# Altium schematic sheet POW_Schematic4.SchDoc
size A4
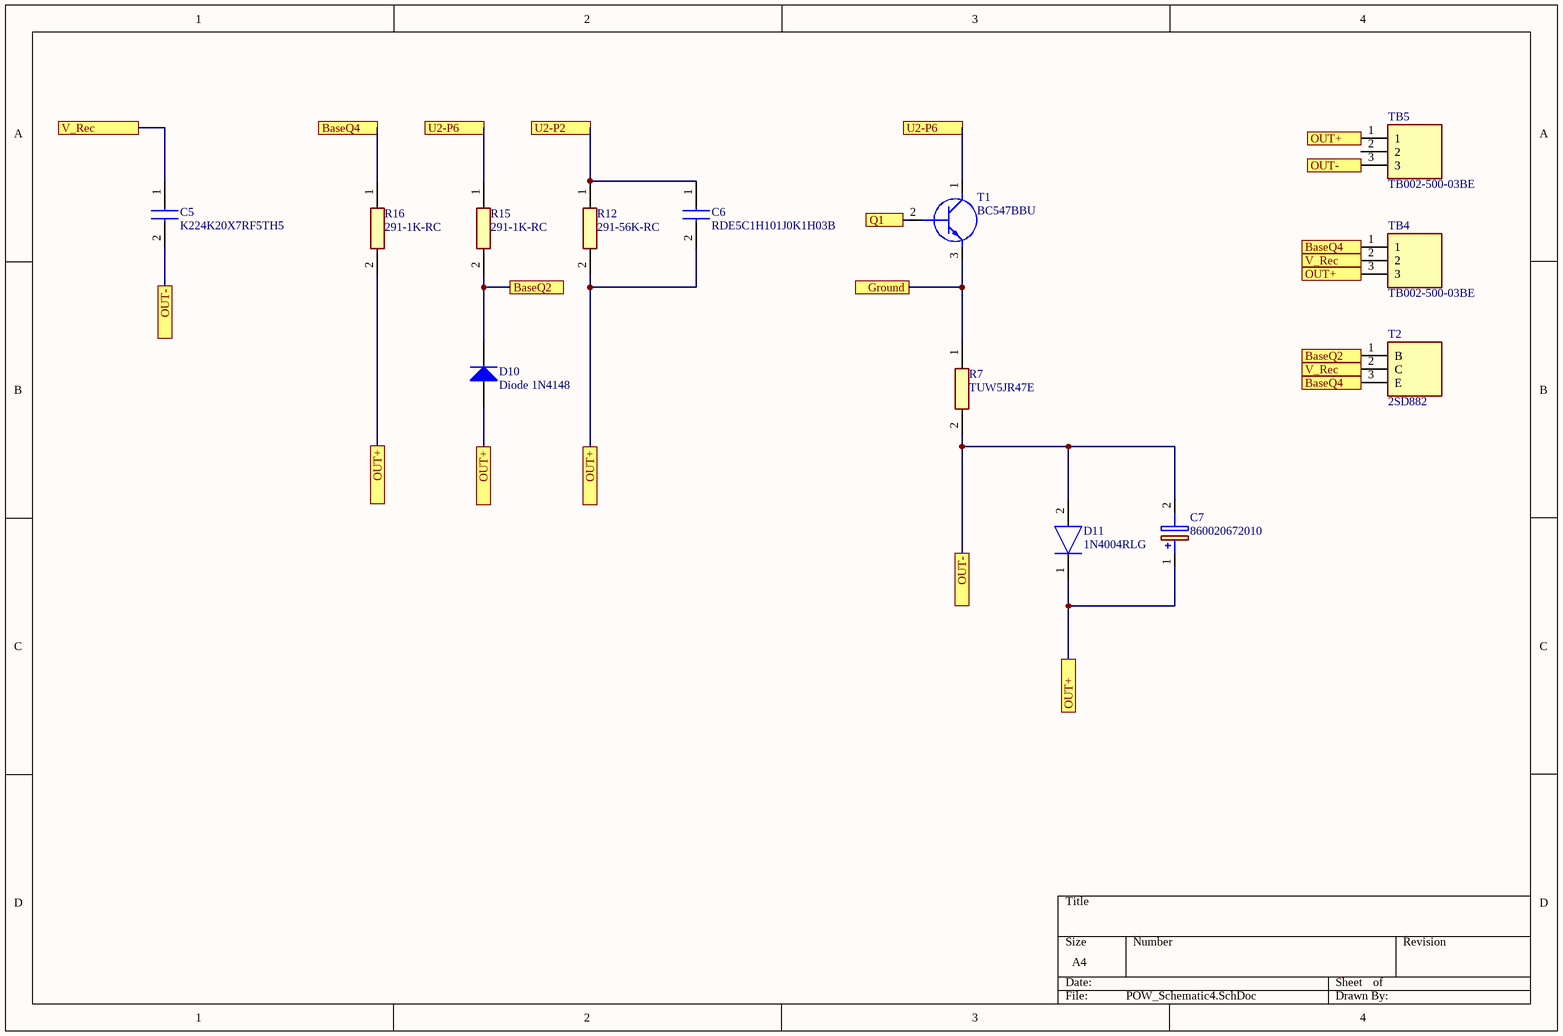
[diagram p0: POW_Schematic4.SchDoc]

## Parts
C5  K224K20X7RF5TH5  [K224K20X7RF5TH5]
C6  RDE5C1H101J0K1H03B  [RCE5C1H103J1A2H03B]
C7  860020672010  [CAPPRD200W52D500H1250]
D10  Diode 1N4148  [DO-35]
D11  1N4004RLG  [DIOAD1405W86L465D235]
R7  TUW5JR47E  [TUW5JR47E]
R12  291-56K-RC  [291-XXX-RC-Type]
R15  291-1K-RC  [291-XXX-RC-Type]
R16  291-1K-RC  [291-XXX-RC-Type]
T1  BC547BBU  [SS9018HBU]
T2  2SD882  [TO254P290X760X1320-3P]
TB4  TB002-500-03BE  [SHDR3W100P0X500_1X3_1500X760X1000P]
TB5  TB002-500-03BE  [SHDR3W100P0X500_1X3_1500X760X1000P]

## Ports
BaseQ2, BaseQ4, Ground, OUT+, OUT-, Q1, U2-P2, U2-P6, V_Rec

## Nets
BaseQ2: D10.2(K) R15.2 T2.1(B) ; port BaseQ2
BaseQ4: R16.1 T2.3(E) TB4.1 ; port BaseQ4
Ground: R7.1 T1.3(E) ; port Ground
OUT+: C6.2 C7.1(+) D10.1(A) D11.1(K) R12.2 R16.2 TB4.3 TB5.1 ; port OUT+
OUT-: C5.2 C7.2(-) D11.2(A) R7.2 TB5.3 ; port OUT-
Q1: T1.2(B) ; port Q1
U2-P2: C6.1 R12.1 ; port U2-P2
U2-P6: R15.1 T1.1(C) ; port U2-P6
V_Rec: C5.1 T2.2(C) TB4.2 ; port V_Rec

Not connected (* = marked no-connect by the designer): TB5 2

## Library data of the parts
C5 = K224K20X7RF5TH5: Capacitor; Manufacturer_Name: Vishay; Allied_Number: 70122947; Datasheet Link: http://www.vishay.com/docs/45171/kseries.pdf; Height: 5mm; Manufacturer_Part_Number: K224K20X7RF5TH5; Mouser Part Number: 594-K224K20X7RF5TH5; Mouser Price/Stock: https://www.mouser.com/Search/Refine.aspx?Keyword=594-K224K20X7RF5TH5; RS Part Number: 8523328; RS Price/Stock: http://uk.rs-online.com/web/p/products/8523328; Allied Price/Stock: https://www.alliedelec.com/bccomponents-vishay-k224k20x7rf5th5/70122947/
C6 = RDE5C1H101J0K1H03B: Capacitor; Manufacturer_Name: Murata Electronics; Datasheet Link: https://psearch.en.murata.com/capacitor/product/RDE5C1H101J0K1H03B.html; Height: 5mm; Manufacturer_Part_Number: RDE5C1H101J0K1H03B; Mouser Part Number: 81-RDE5C1H101J0K1H3B; Mouser Price/Stock: https://www.mouser.com/Search/Refine.aspx?Keyword=81-RDE5C1H101J0K1H3B
C7 = 860020672010: Capacitor Polarised; Manufacturer_Name: Wurth Elektronik; Datasheet Link: https://katalog.we-online.de/pbs/datasheet/860020672010.pdf; Height: 12.5mm; Manufacturer_Part_Number: 860020672010; Mouser Part Number: 710-860020672010; Mouser Price/Stock: https://www.mouser.com/Search/Refine.aspx?Keyword=710-860020672010; RS Part Number: 8396621P; RS Price/Stock: http://uk.rs-online.com/web/p/products/8396621P
D10 = Diode 1N4148: High Conductance Fast Diode; Published: 8-Jun-2000; LatestRevisionDate: 17-Jul-2002; LatestRevisionNote: Re-released for DXP Platform.; DatasheetVersion: 1997; PackageReference: DO-35; Publisher: Altium Limited; PackageDescription: Diode, Axial; Body 3.8 x 1.9 mm (LxDia. max), Lead Dia. 0.53 mm (max); Code_JEDEC: DO-204-AH; ComponentLink1Description: Manufacturer Link; ComponentLink1URL: http://www.fairchildsemi.com/; ComponentLink2Description: Datasheet; ComponentLink2URL: http://www.fairchildsemi.com/ds/1N%2F1N4148.pdf
D11 = 1N4004RLG: Diode; Manufacturer_Name: ON Semiconductor; Datasheet Link: http://www.onsemi.com/pub/Collateral/1N4001-D.PDF; Manufacturer_Part_Number: 1N4004RLG; Mouser Part Number: 863-1N4004RLG; Mouser Price/Stock: https://www.mouser.com/Search/Refine.aspx?Keyword=863-1N4004RLG; RS Part Number: 1844627P; RS Price/Stock: http://uk.rs-online.com/web/p/products/1844627P
R7 = TUW5JR47E: Resistor; Manufacturer_Name: Ohmite; Allied_Number: 70024726; Datasheet Link: https://componentsearchengine.com/Datasheets/2/TUW5JR47E.pdf; Manufacturer_Part_Number: TUW5JR47E; Mouser Part Number: 588-TUW5JR47E; Mouser Price/Stock: https://www.mouser.com/Search/Refine.aspx?Keyword=588-TUW5JR47E; RS Part Number: 8934166; RS Price/Stock: http://uk.rs-online.com/web/p/products/8934166; Allied Price/Stock: https://www.alliedelec.com/ohmite-tuw5jr47e/70024726/
T1 = BC547BBU: Transistor BJT NPN; Manufacturer_Name: ON Semiconductor; Datasheet Link: http://www.onsemi.com/pub/Collateral/BC550-D.pdf; Manufacturer_Part_Number: BC547BBU; Mouser Part Number: 512-BC547BBU; Mouser Price/Stock: https://www.mouser.com/Search/Refine.aspx?Keyword=512-BC547BBU; RS Part Number: 8031083P; RS Price/Stock: http://uk.rs-online.com/web/p/products/8031083P
T2 = 2SD882: Integrated Circuit; Manufacturer_Name: STMicroelectronics; Allied_Number: 70389765; Datasheet Link: http://www.st.com/web/en/resource/technical/document/datasheet/CD00062867.pdf; Height: 2.9mm; Manufacturer_Part_Number: 2SD882; Mouser Part Number: 511-2SD882; Mouser Price/Stock: https://www.mouser.com/Search/Refine.aspx?Keyword=511-2SD882; RS Part Number: 6868045P; RS Price/Stock: http://uk.rs-online.com/web/p/products/6868045P; Allied Price/Stock: http://www.alliedelec.com/stmicroelectronics-2sd882/70389765/
TB4 TB5 = TB002-500-03BE: Connector; Manufacturer_Name: CUI Devices; Datasheet Link: https://www.cuidevices.com/product/resource/tb002-500.pdf; Height: 10mm; Manufacturer_Part_Number: TB002-500-03BE; Mouser Part Number: 490-TB002-500-03BE; Mouser Price/Stock: https://www.mouser.com/Search/Refine.aspx?Keyword=490-TB002-500-03BE